# Altium project 半桥模块1.PrjPcb
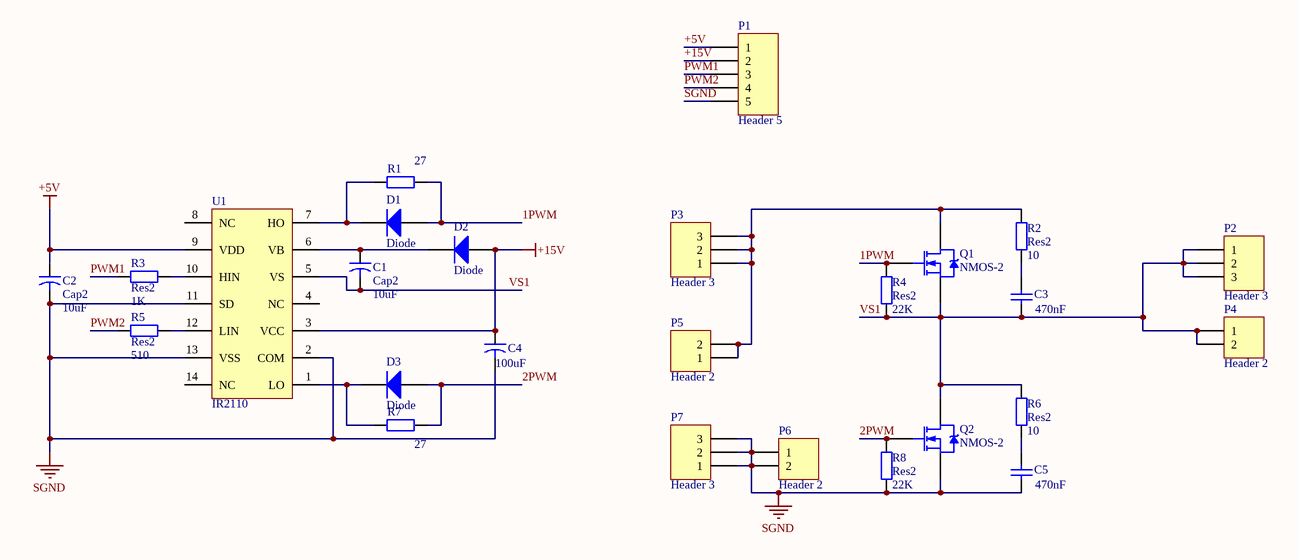
[diagram p0: 半桥模块1.SchDoc]
1 sheet, 26 parts. Net scope: global (net labels, ports and power ports of the same name join across sheets).
Board file: 半桥模块1.PcbDoc

## Sheet 半桥模块1.SchDoc
size A4

### Parts
C1  Cap2  value 10uF  [C-10uF]
C2  Cap2  value 10uF  [C-10uF]
C3  value 470nF  [DuanZi]  (hidden comment: Cap)
C4  value 100uF  [C-10uF]  (hidden comment: Cap2)
C5  value 470nF  [DuanZi]  (hidden comment: Cap)
D1  Diode  [DO-41]
D2  Diode  [DO-41]
D3  Diode  [DO-41]
P1  Header 5  [3.81mm_5]
P2  Header 3  [HDR1X3]
P3  Header 3  [HDR1X3]
P4  Header 2  [DuanZi]
P5  Header 2  [DuanZi]
P6  Header 2  [DuanZi]
P7  Header 3  [HDR1X3]
Q1  NMOS-2  [MOS]
Q2  NMOS-2  [MOS]
R1  value 27  [AXIAL0.4-1/4W]  (hidden comment: Res2)
R2  Res2  value 10  [R_5W]
R3  Res2  value 1K  [AXIAL0.4-1/4W]
R4  Res2  value 22K  [AXIAL0.4-1/4W]
R5  Res2  value 510  [AXIAL0.4-1/4W]
R6  Res2  value 10  [R_5W]
R7  value 27  [AXIAL0.4-1/4W]  (hidden comment: Res2)
R8  Res2  value 22K  [AXIAL0.4-1/4W]
U1  IR2110  [DIP14-300_MH]

### Nets
+5V: C2.1 P1.1 U1.9(VDD)
+15V: C4.1 D2.1(A) P1.2 U1.3(VCC)
SGND: C2.2 C4.2 C5.1 P1.5 P6.1 P6.2 P7.1 P7.2 P7.3 Q2.3(S) R8.1 U1.2(COM) U1.11(SD) U1.13(VSS)
1PWM: D1.1(A) Q1.1(G) R1.2 R4.2
2PWM: D3.1(A) Q2.1(G) R7.2 R8.2
PWM1: P1.3 R3.1
PWM2: P1.4 R5.1
VS1: C1.2 C3.1 P2.1 P2.2 P2.3 P4.1 P4.2 Q1.3(S) Q2.2(D) R4.1 R6.2 U1.5(VS)
NetC1_1: C1.1 D2.2(K) U1.6(VB)
NetC3_2: C3.2 R2.1
NetC5_2: C5.2 R6.1
NetD1_2: D1.2(K) R1.1 U1.7(HO)
NetD3_2: D3.2(K) R7.1 U1.1(LO)
NetP3_1: P3.1 P3.2 P3.3 P5.1 P5.2 Q1.2(D) R2.2
NetR3_2: R3.2 U1.10(HIN)
NetR5_2: R5.2 U1.12(LIN)

Not connected (* = marked no-connect by the designer): U1 4(NC) 8(NC) 14(NC)

### Library data of the parts
C1 C2 C4 = Cap2: Capacitor; Published: 23-Sep-2002; PackageReference: CAPR5-4X5; Publisher: Altium Limited; PackageDescription: Capacitor; 2 Leads
C3 C5 = Cap: Capacitor; Published: 8-Jun-2000; LatestRevisionDate: 17-Jul-2002; LatestRevisionNote: Re-released for DXP Platform.; PackageReference: RAD-0.3; Publisher: Altium Limited; PackageDescription: Radial Cap, Thru-Hole; 2 Leads; 0.3 in Pin Spacing
D1-D3 = Diode: Default Diode; Published: 8-Jun-2000; LatestRevisionDate: 17-Jul-2002; LatestRevisionNote: Re-released for DXP Platform.; PackageVersion: Sep-1996; PackageReference: SMC; Publisher: Altium Limited; PackageDescription: DO-214-AB/SMC; 2 C-Bend Leads; Body 7.9 x 5.9 mm, inc. leads (LxW); Code_JEDEC: DO-214-AB
P1 = Header 5: Header, 5-Pin; LatestRevisionDate: 17-Jul-2002; LatestRevisionNote: Re-released for DXP Platform.; Publisher: Altium Limited
P2 P3 P7 = Header 3: Header, 3-Pin; LatestRevisionDate: 17-Jul-2002; LatestRevisionNote: Re-released for DXP Platform.; Publisher: Altium Limited
P4-P6 = Header 2: Header, 2-Pin; LatestRevisionDate: 17-Jul-2002; LatestRevisionNote: Re-released for DXP Platform.; Publisher: Altium Limited
Q1 Q2 = NMOS-2: N-Channel Power MOSFET; Note: Pin 2 is electrically connected to pin 4.; Published: 8-Jun-2000; LatestRevisionDate: 17-Jul-2002; LatestRevisionNote: Re-released for DXP Platform.; DatasheetVersion: PD-9.814; PackageVersion: Feb-1997; PackageReference: TO-220AB; Publisher: Altium Limited; PackageDescription: TO, Thru-Hole, Vertical, Heatsink Mounted; 3 In-Line Leads; Pitch 2.54 mm; ComponentLink1Description: Manufacturer Link; ComponentLink1URL: http://www.irf.com/
R1-R8 = Res2: Resistor; Published: 8-Jun-2000; LatestRevisionDate: 17-Jul-2002; LatestRevisionNote: Re-released for DXP Platform.; PackageReference: AXIAL-0.4; Publisher: Altium Limited; PackageDescription: Axial Device, Thru-Hole; 2 Leads; 0.4 in Pin Spacing